# EasyEDA schematic ESP Home Automation.json

## Sheets
1 Sheet_1: TITLE: ESP Relay; REV: 1.0; Date: 2022-01-20; Sheet: 1/4
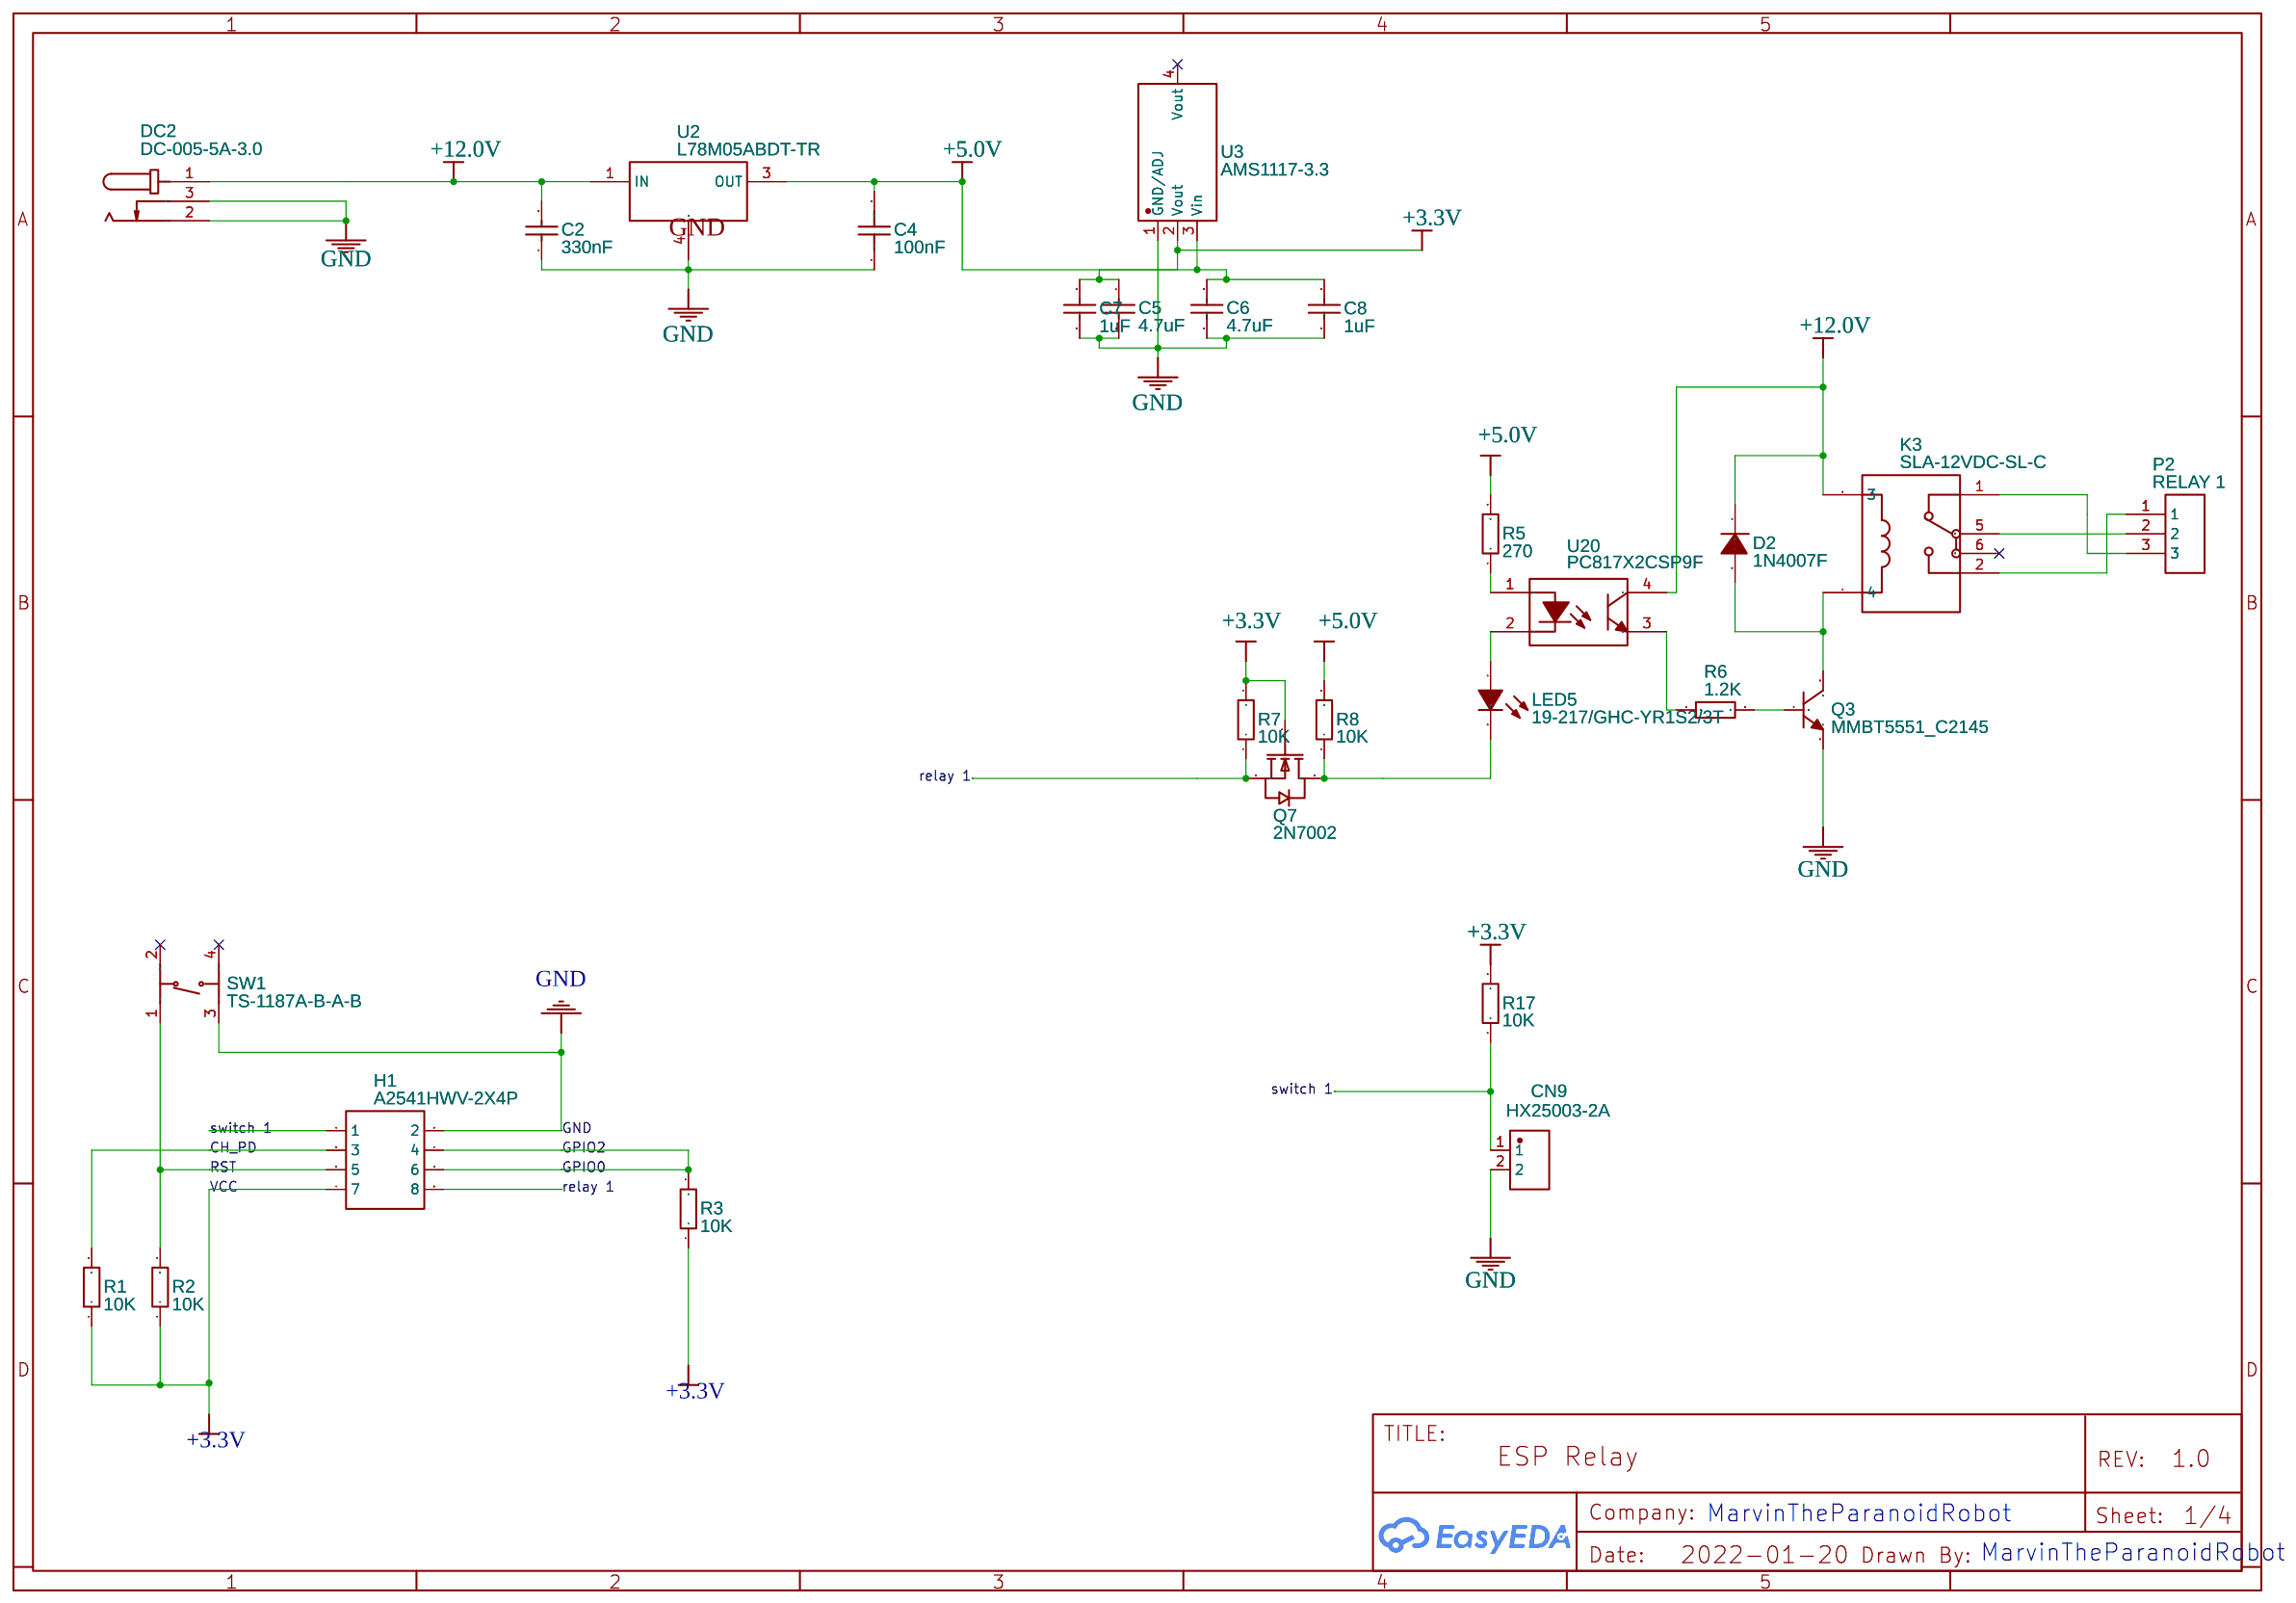
[diagram p0: Sheet_1]
2 Sheet_2: TITLE: ESP Mosfet; Sheet: 2/4
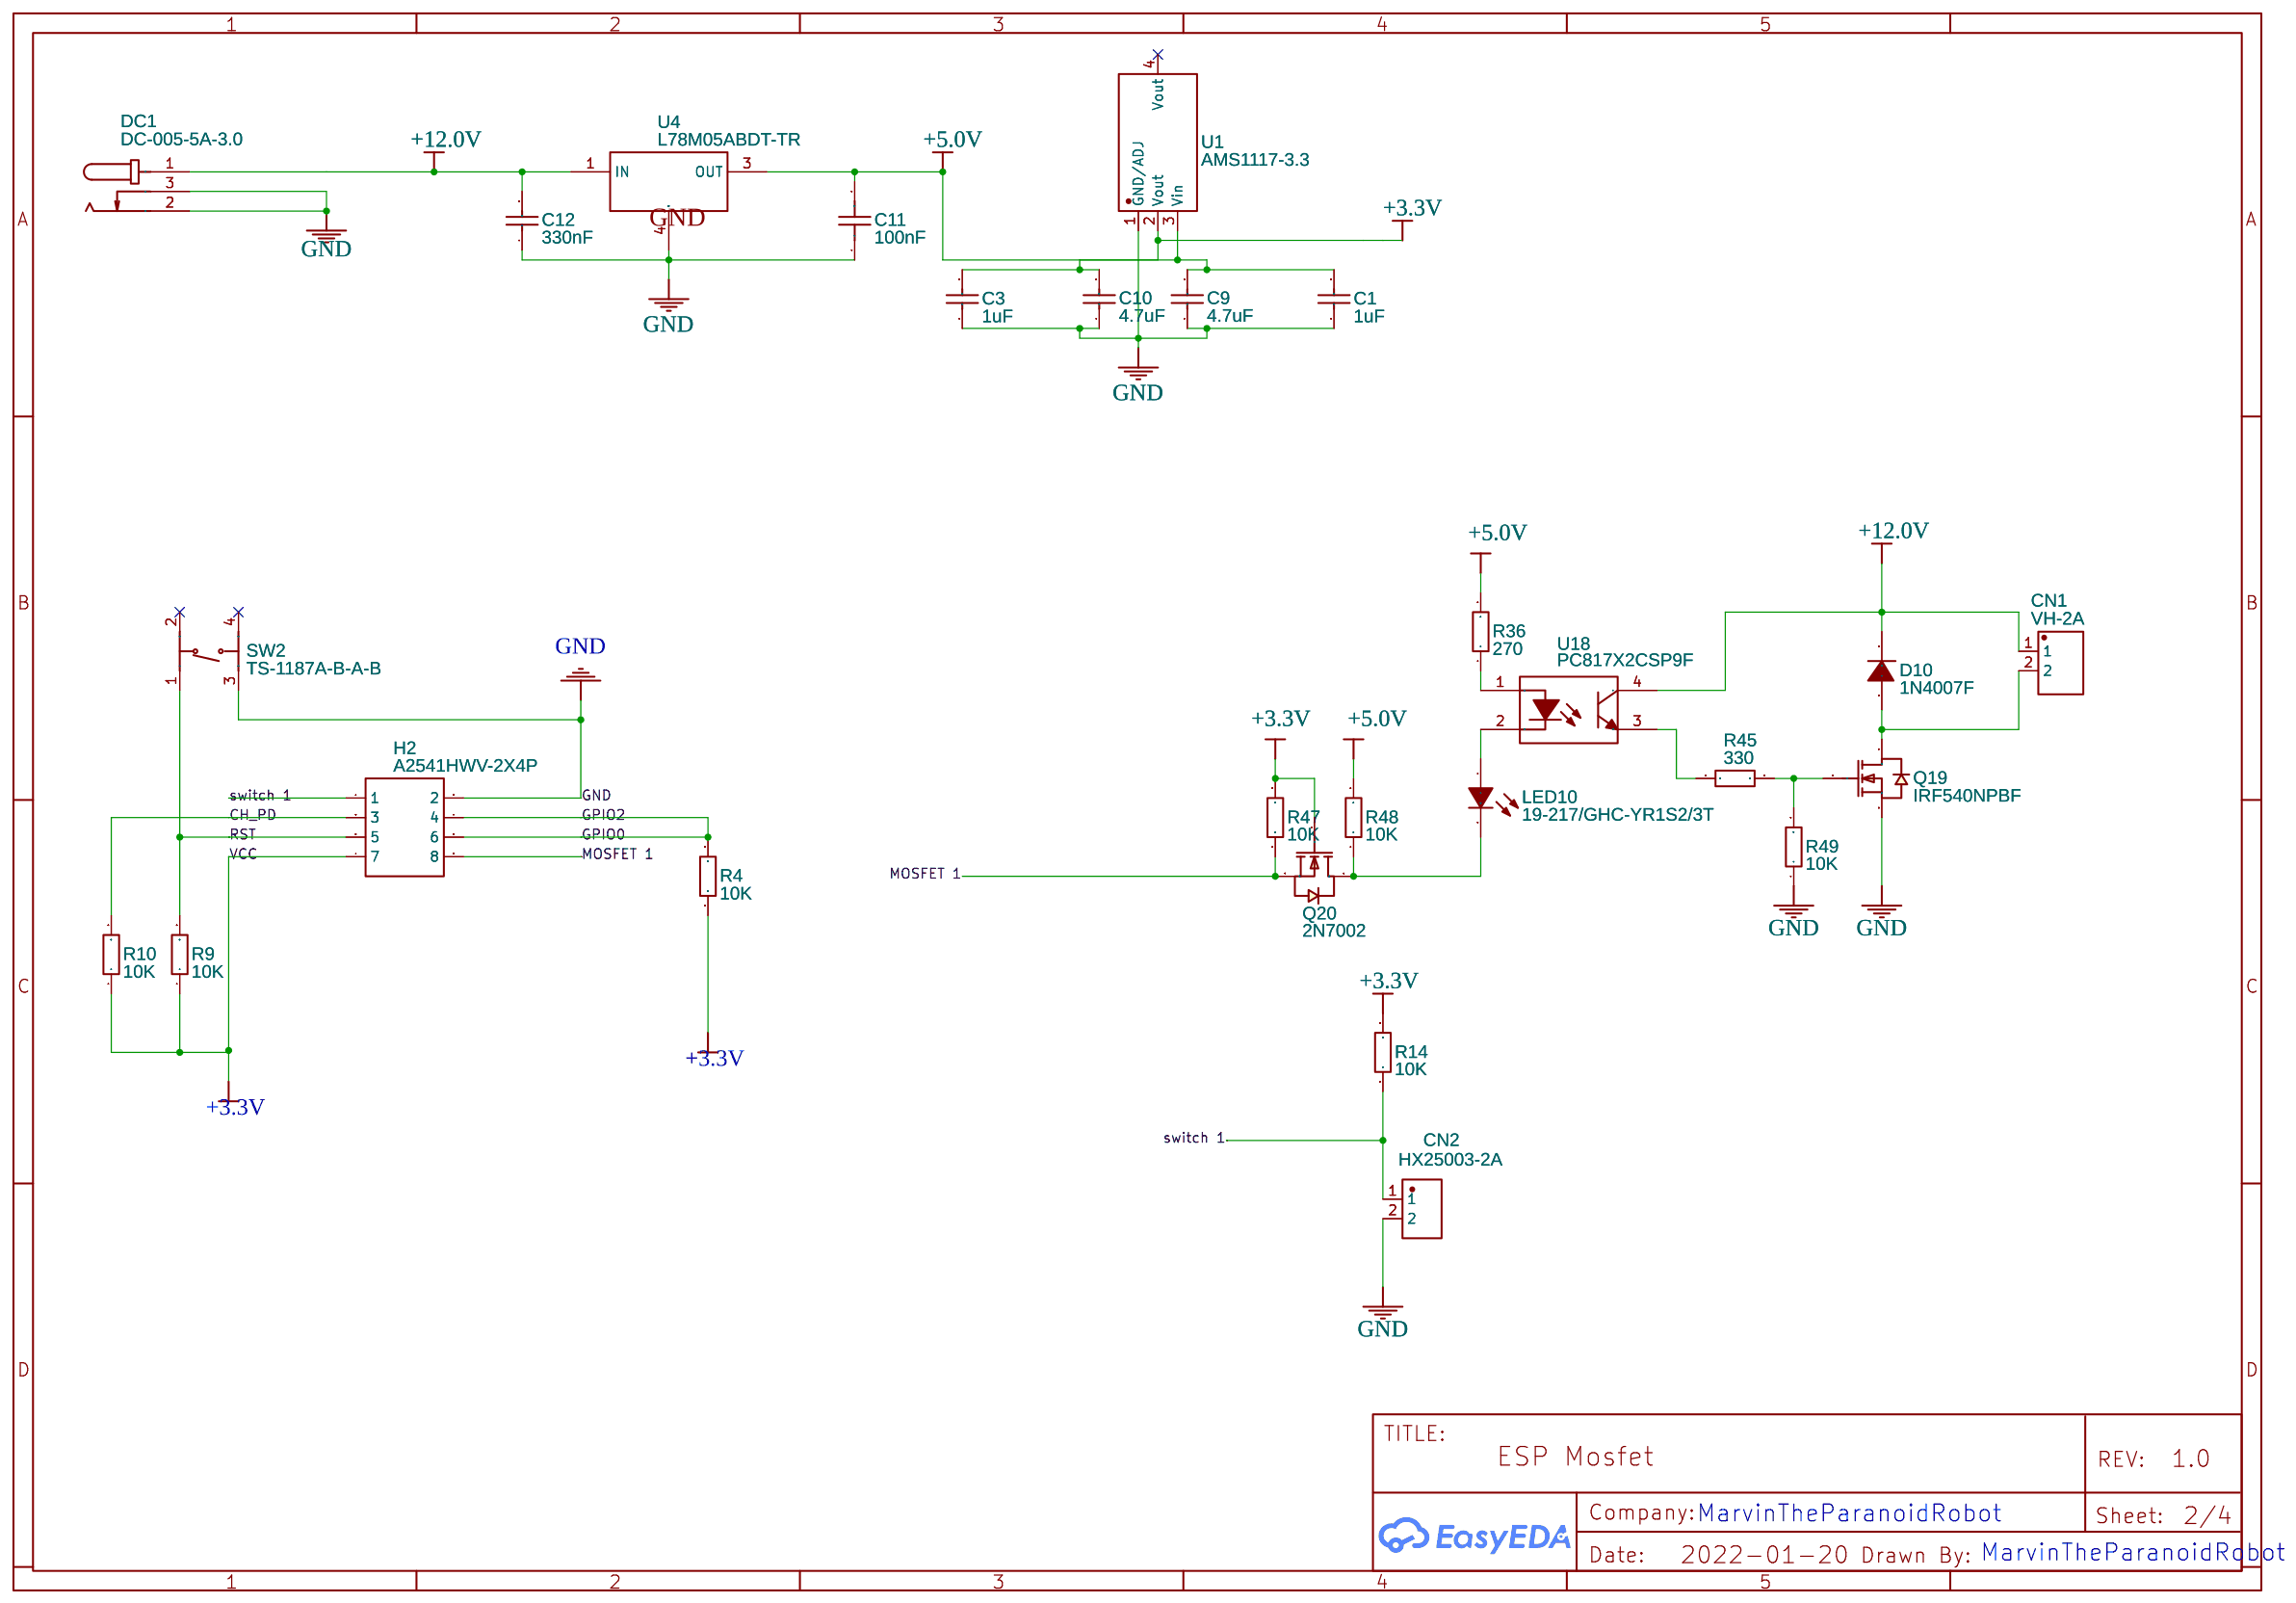
[diagram p1: Sheet_2]
3 Sheet_3: TITLE: ESP WS2801B; Date: 2022-01-21; Sheet: 3/4
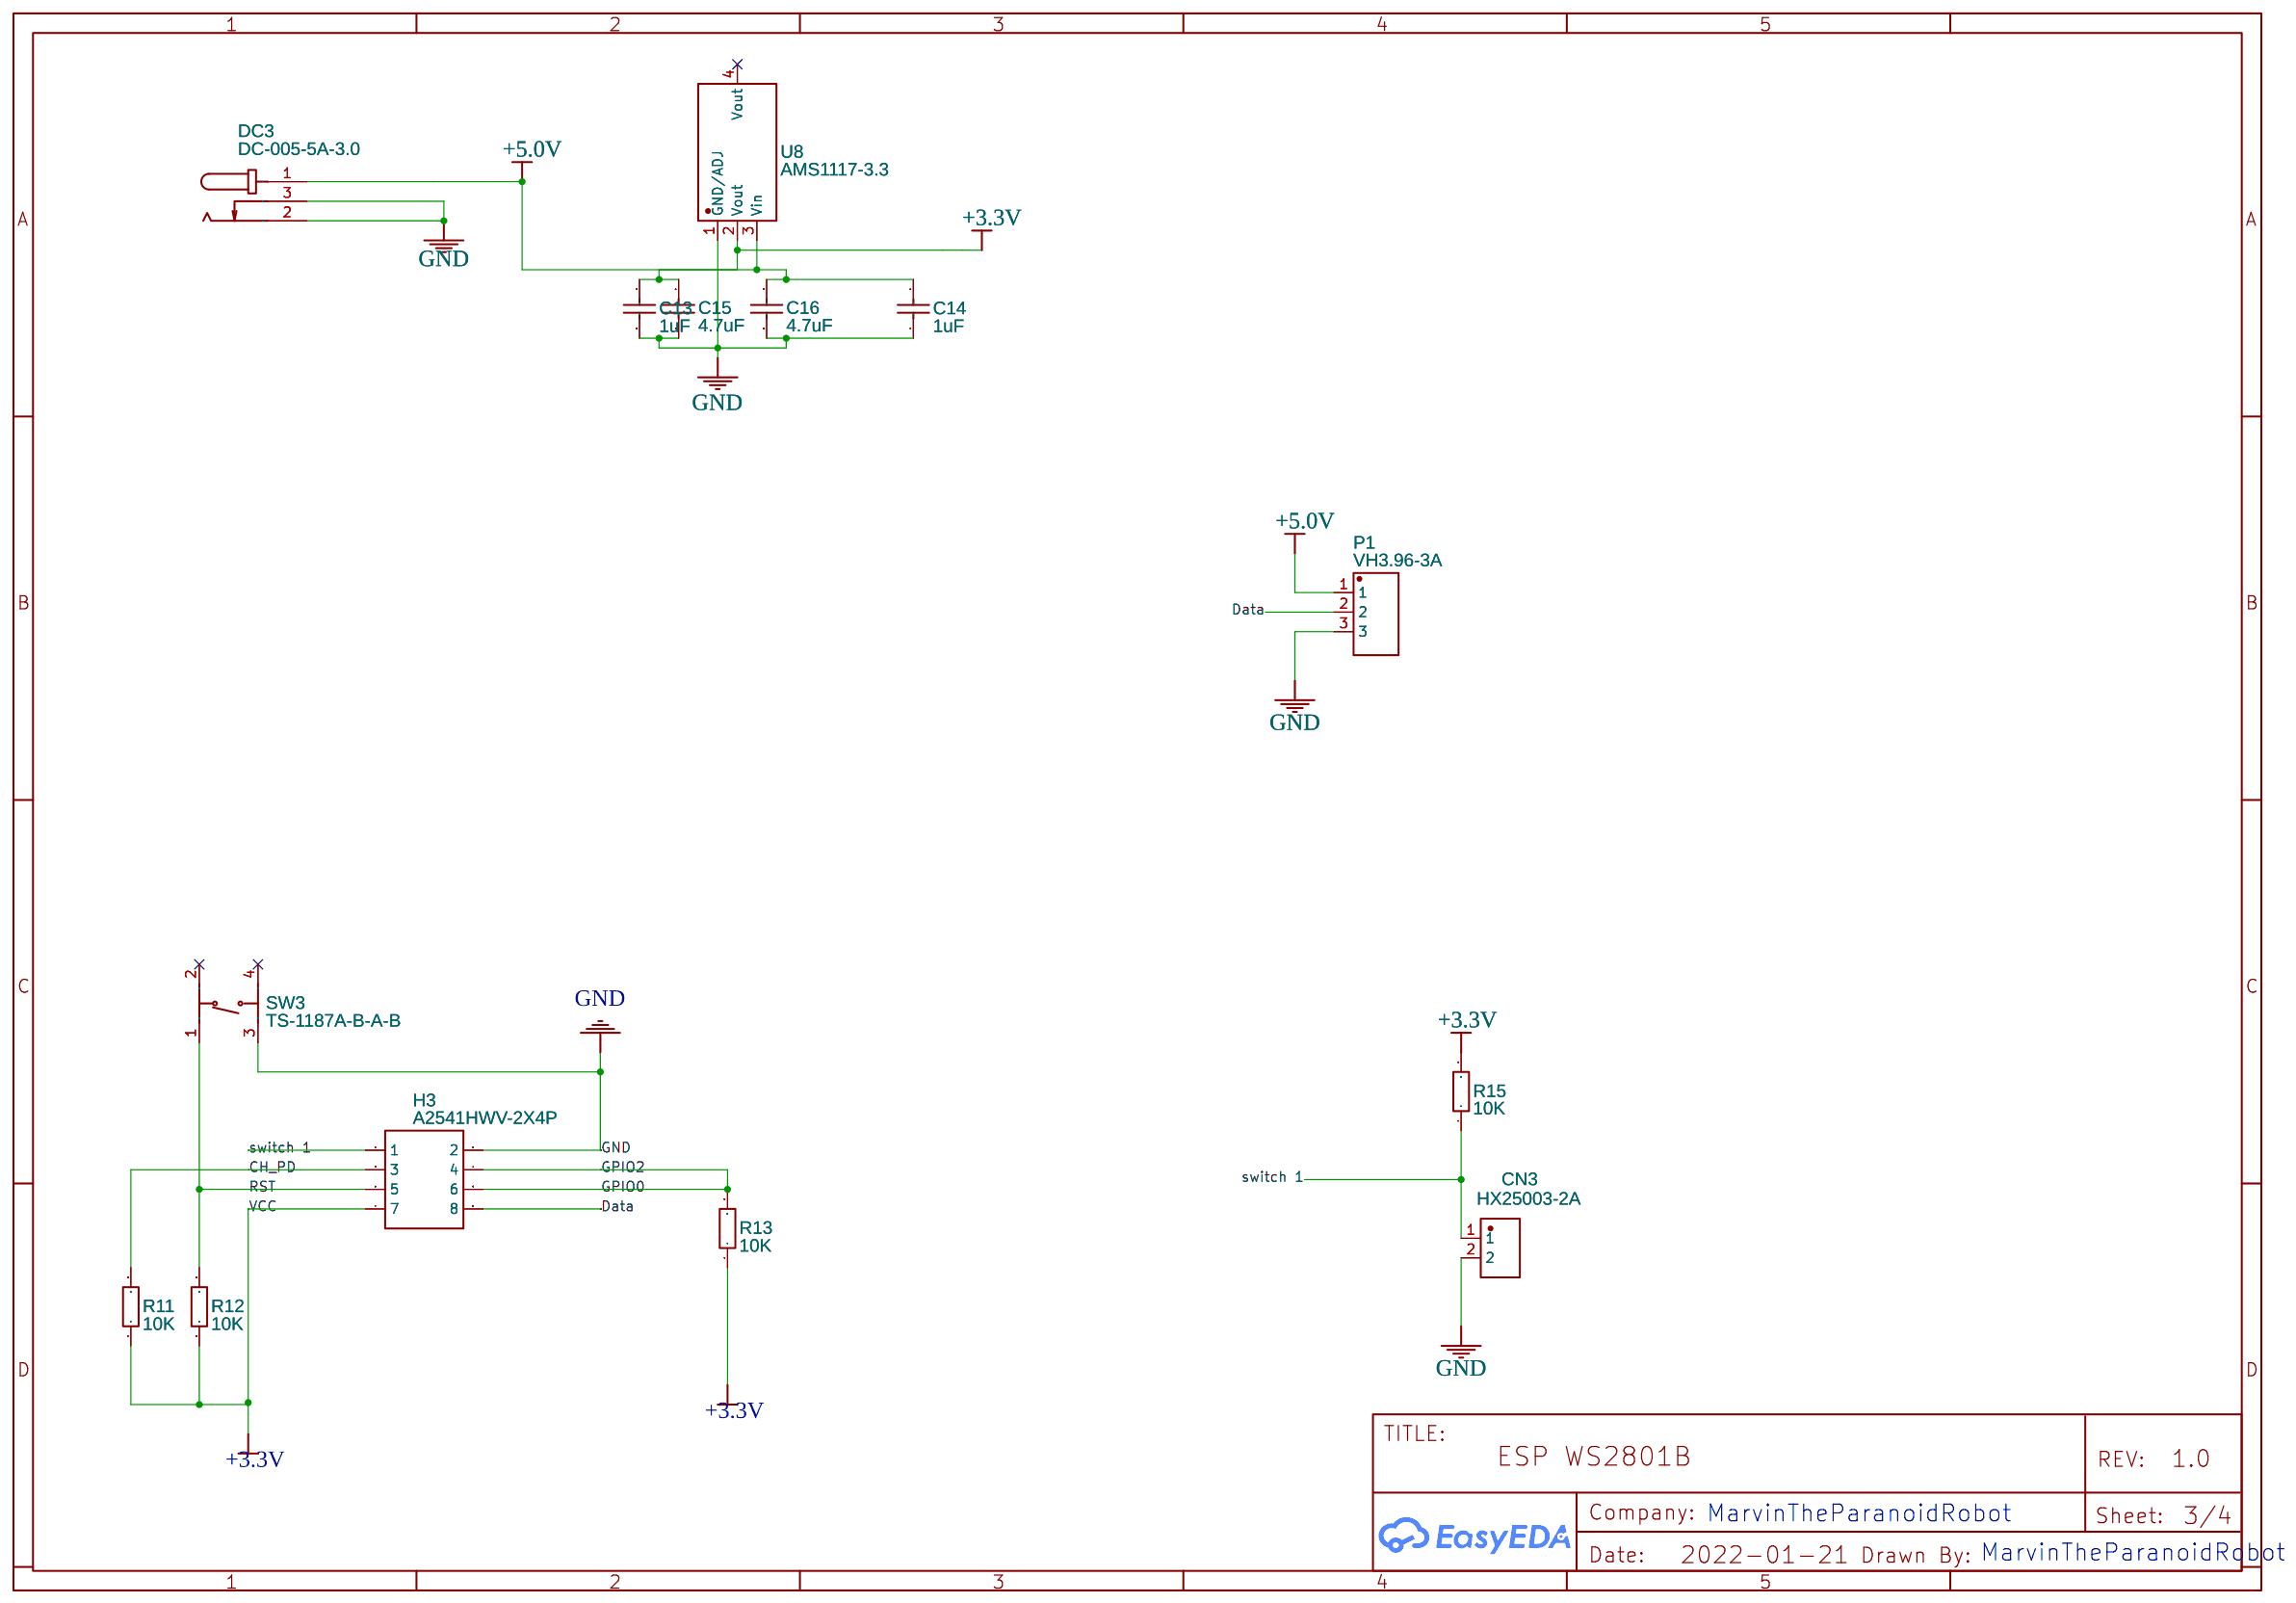
[diagram p2: Sheet_3]
4 Sheet_4: TITLE: Sheet_4; Date: 2022-01-23; Sheet: 4/4; Company: MarvinTheParanoidRobot
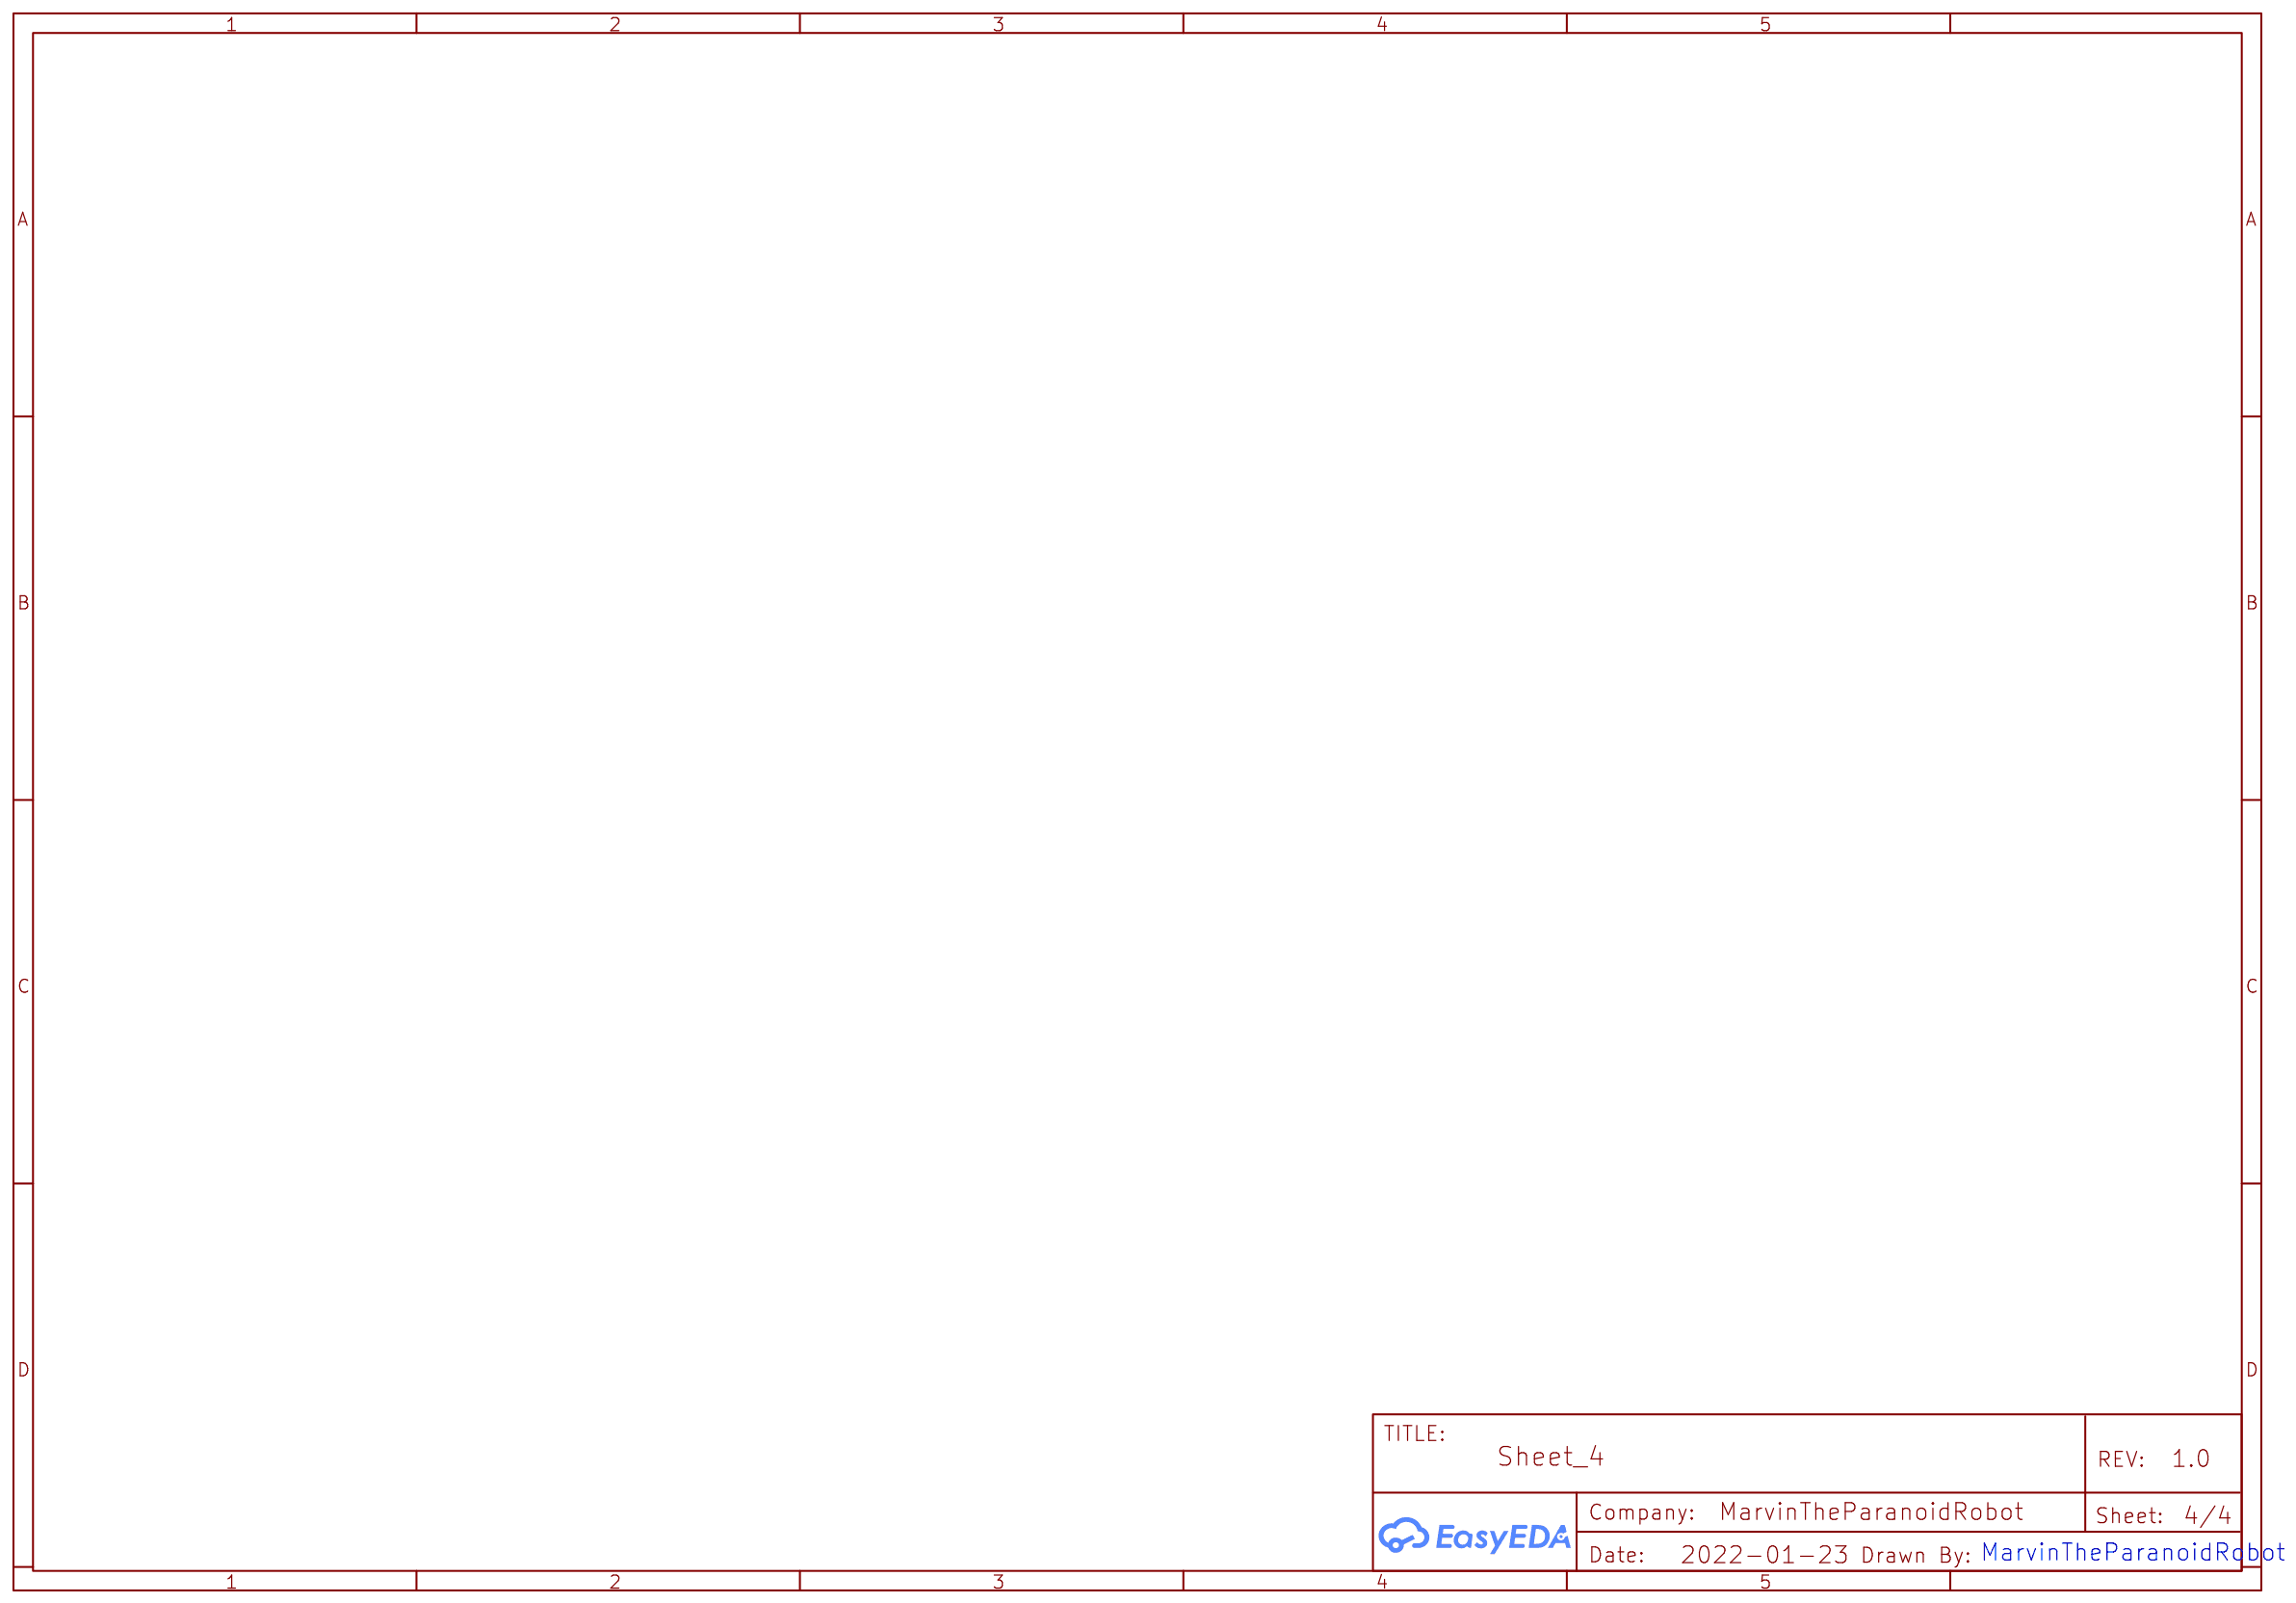
[diagram p3: Sheet_4]

## Parts
sheet Sheet_1
C2  330nF  [C0805]
C4  100nF  [C0603]
C5  4.7uF  [C1206]
C6  4.7uF  [C1206]
C7  1uF  [C0603]
C8  1uF  [C0603]
CN9  HX25003-2A  [CONN-TH_2P-P2.50_HX25003-2A]
D2  1N4007F  [SMAF_L3.5-W2.6-LS4.7-RD]
DC2  DC-005-5A-3.0  [DC-IN-TH_DC-005-5A-3.0]
H1  A2541HWV-2X4P  [HDR-TH_8P-P2.54-V-F-R2-C4-S2.54-1]
K3  SLA-12VDC-SL-C  [RELAY-TH_SLA-12VDC-SL-C]
LED5  19-217/GHC-YR1S2/3T  [LED0603-R-RD]
P2  RELAY 1  [CONN-TH_3P-P5.00_WJ128V-5.0-3P]
Q3  MMBT5551_C2145  [SOT-23-3_L2.9-W1.3-P1.90-LS2.4-BR]
Q7  2N7002  [SOT-23-3_L2.9-W1.3-P1.90-LS2.4-BR]
R1  10K  [R1206]
R2  10K  [R1206]
R3  10K  [R1206]
R5  270  [R0603]
R6  1.2K  [R0805]
R7  10K  [R1206]
R8  10K  [R1206]
R17  10K  [R1206]
SW1  TS-1187A-B-A-B  [SW-SMD_4P-L5.1-W5.1-P3.70-LS6.5-TL-2]
U2  L78M05ABDT-TR  [TO-252-2_L6.5-W6.1-P4.58-LS10.0-TL]
U3  AMS1117-3.3  [SOT-223-3_L6.5-W3.4-P2.30-LS7.0-BR]
U20  PC817X2CSP9F  [SMD-4_L4.6-W6.5-P2.54-LS10.2-TL]
sheet Sheet_2
C1  1uF  [C0603]
C3  1uF  [C0603]
C9  4.7uF  [C1206]
C10  4.7uF  [C1206]
C11  100nF  [C0603]
C12  330nF  [C0805]
CN1  VH-2A  [CONN-TH_VH3.96-2A]
CN2  HX25003-2A  [CONN-TH_2P-P2.50_HX25003-2A]
D10  1N4007F  [SMAF_L3.5-W2.6-LS4.7-RD]
DC1  DC-005-5A-3.0  [DC-IN-TH_DC-005-5A-3.0]
H2  A2541HWV-2X4P  [HDR-TH_8P-P2.54-V-F-R2-C4-S2.54-1]
LED10  19-217/GHC-YR1S2/3T  [LED0603-R-RD]
Q19  IRF540NPBF  [TO-220-3_L10.0-W4.5-P2.54-L]
Q20  2N7002  [SOT-23-3_L2.9-W1.3-P1.90-LS2.4-BR]
R4  10K  [R1206]
R9  10K  [R1206]
R10  10K  [R1206]
R14  10K  [R1206]
R36  270  [R0603]
R45  330  [R0805]
R47  10K  [R1206]
R48  10K  [R1206]
R49  10K  [R1206]
SW2  TS-1187A-B-A-B  [SW-SMD_4P-L5.1-W5.1-P3.70-LS6.5-TL-2]
U1  AMS1117-3.3  [SOT-223-3_L6.5-W3.4-P2.30-LS7.0-BR]
U4  L78M05ABDT-TR  [TO-252-2_L6.5-W6.1-P4.58-LS10.0-TL]
U18  PC817X2CSP9F  [SMD-4_L4.6-W6.5-P2.54-LS10.2-TL]
sheet Sheet_3
C13  1uF  [C0603]
C14  1uF  [C0603]
C15  4.7uF  [C1206]
C16  4.7uF  [C1206]
CN3  HX25003-2A  [CONN-TH_2P-P2.50_HX25003-2A]
DC3  DC-005-5A-3.0  [DC-IN-TH_DC-005-5A-3.0]
H3  A2541HWV-2X4P  [HDR-TH_8P-P2.54-V-F-R2-C4-S2.54-1]
P1  VH3.96-3A  [CONN-TH_3P-P3.96_VH3.96-3A]
R11  10K  [R1206]
R12  10K  [R1206]
R13  10K  [R1206]
R15  10K  [R1206]
SW3  TS-1187A-B-A-B  [SW-SMD_4P-L5.1-W5.1-P3.70-LS6.5-TL-2]
U8  AMS1117-3.3  [SOT-223-3_L6.5-W3.4-P2.30-LS7.0-BR]

## Library data of the parts
C2 C12 = 0805B334K500NT: Supplier: LCSC; Manufacturer: FH; Supplier Part: C1740; JLCPCB Part Class: Basic Part
C4 C11 = CC0603KRX7R9BB104: Supplier: LCSC; Manufacturer: YAGEO; Supplier Part: C14663; JLCPCB Part Class: Basic Part
C5 C6 C9 C10 C15 C16 = 1206B475K500NT: Supplier: LCSC; Manufacturer: FH; Supplier Part: C29823; JLCPCB Part Class: Basic Part
C1 C3 C7 C8 C13 C14 = CL10A105KB8NNNC: Supplier: LCSC; Manufacturer: SAMSUNG; Supplier Part: C15849; JLCPCB Part Class: Basic Part
CN2 CN3 CN9 = HX25003-2A: Supplier: LCSC; Supplier Part: C442299; Manufacturer: HX(Zhejiang Yueqing Hongxing Elec); Contributor: LCSC; JLCPCB Part Class: Extended Part
D2 D10 = 1N4007F: Supplier: LCSC; Manufacturer: SK; Supplier Part: C110856; JLCPCB Part Class: Extended Part
DC1-DC3 = DC-005-5A-3.0: Supplier: LCSC; Supplier Part: C388625; Manufacturer: XKB Enterprise; Contributor: LCSC; JLCPCB Part Class: Extended Part
H1-H3 = A2541HWV-2X4P: Supplier: LCSC; Supplier Part: C239344; Manufacturer: Changjiang Connectors; Manufacturer Part: A2541HWV-2x4P; Contributor: LCSC; link: https://item.szlcsc.com/238448.html?ref=editor&logined=true; JLCPCB Part Class: Extended Part
K3 = SLA-12VDC-SL-C: Supplier: LCSC; Manufacturer: SONGLE; Contributor: LCSC; Supplier Part: C125736; JLCPCB Part Class: Extended Part
LED5 LED10 = 19-217/GHC-YR1S2/3T: Supplier: LCSC; Manufacturer: EVERLIGHT; Supplier Part: C72043; JLCPCB Part Class: Basic Part
P2 = WJ128V-5.0-3P: Supplier: LCSC; Manufacturer: ReliaPro; Supplier Part: C8270; JLCPCB Part Class: Extended Part
Q3 = MMBT5551_C2145: Supplier: LCSC; Manufacturer: CJ; Manufacturer Part: MMBT5551; Supplier Part: C2145; JLCPCB Part Class: Basic Part
Q7 Q20 = 2N7002: Supplier: LCSC; Manufacturer: CJ; Supplier Part: C8545; JLCPCB Part Class: Basic Part
R1-R4 R7-R15 R17 R47-R49 = 1206W4F1002T5E: Supplier: LCSC; Manufacturer: UniOhm; Supplier Part: C17902; JLCPCB Part Class: Basic Part
R5 R36 = 0603WAF2700T5E: Supplier: LCSC; Manufacturer: UniOhm; Supplier Part: C22966; JLCPCB Part Class: Basic Part
R6 = 0805W8F1201T5E: Supplier: LCSC; Manufacturer: UniOhm; Supplier Part: C17379; JLCPCB Part Class: Basic Part
SW1-SW3 = TS-1187A-B-A-B: Supplier: LCSC; Supplier Part: C318884; Manufacturer: XKB Enterprise; Contributor: LCSC; JLCPCB Part Class: Extended Part
U2 U4 = L78M05ABDT-TR: Supplier: LCSC; Manufacturer: STMicroelectronics; Supplier Part: C58069; JLCPCB Part Class: Basic Part
U1 U3 U8 = AMS1117-3.3: sourceId: dwIGgezVh; Supplier: LCSC; Manufacturer: AMS; Supplier Part: C6186; JLCPCB Part Class: Basic Part
U18 U20 = PC817X2CSP9F: Supplier: LCSC; Manufacturer: SHARP; Supplier Part: C66405; JLCPCB Part Class: Extended Part
CN1 = VH-2A: Supplier: LCSC; Manufacturer: BOOMELE; Supplier Part: C16728; JLCPCB Part Class: Extended Part
Q19 = IRF540NPBF: Supplier: LCSC; Manufacturer: Infineon; Supplier Part: C2566; JLCPCB Part Class: Extended Part
R45 = 0805W8F3300T5E: Supplier: LCSC; Manufacturer: UniOhm; Supplier Part: C17630; JLCPCB Part Class: Basic Part
P1 = VH3.96-3A: Supplier: LCSC; Manufacturer: BOOMELE; Supplier Part: C20547; JLCPCB Part Class: Extended Part

## Nets
+3.3V: C3.2 C5.2 C7.2 C10.2 C13.2 C15.2 H1.7 H2.7 H3.7 Q7.1(G) Q20.1(G) R1.1 R2.1 R3.1 R4.1 R7.2 R9.1 R10.1 R11.1 R12.1 R13.1 R14.2 R15.2 R17.2 R47.2 U1.2(Vout) U3.2(Vout) U8.2(Vout)
+5.0V: C1.2 C4.2 C6.2 C8.2 C9.2 C11.2 C14.2 C16.2 DC3.1 P1.1 R5.2 R8.2 R36.2 R48.2 U1.3(Vin) U2.3(OUT) U3.3(Vin) U4.3(OUT) U8.3(Vin)
+12.0V: C2.2 C12.2 CN1.1 D2.1(C) D10.1(C) DC1.1 DC2.1 K3.3 U2.1(IN) U4.1(IN) U18.4 U20.4
GND: C1.1 C2.1 C3.1 C4.1 C5.1 C6.1 C7.1 C8.1 C9.1 C10.1 C11.1 C12.1 C13.1 C14.1 C15.1 C16.1 CN2.2 CN3.2 CN9.2 DC1.2 DC1.3 DC2.2 DC2.3 DC3.2 DC3.3 H1.2 H2.2 H3.2 P1.3 Q3.2(E) Q19.3(S) R49.1 SW1.3(C) SW2.3(C) SW3.3(C) U1.1(GND/ADJ) U2.4(GND) U3.1(GND/ADJ) U4.4(GND) U8.1(GND/ADJ)
CH_PD: H1.3 H2.3 H3.3 R1.2 R10.2 R11.2
Data: H3.8 P1.2
GPIO0: H1.4 H1.6 H2.4 H2.6 H3.4 H3.6 R3.2 R4.2 R13.2
MOSFET 1: H2.8 Q20.2(S) R47.1
relay 1: H1.8 Q7.2(S) R7.1
RST: H1.5 H2.5 H3.5 R2.2 R9.2 R12.2 SW1.1(A) SW2.1(A) SW3.1(A)
switch 1: CN2.1 CN3.1 CN9.1 H1.1 H2.1 H3.1 R14.1 R15.1 R17.1
Net-(CN1-2): CN1.2 D10.2(A) Q19.2(D)
Net-(D2-2): D2.2(A) K3.4 Q3.3(C)
Net-(K3-1): K3.1 P2.3
Net-(K3-2): K3.2 P2.1
Net-(K3-5): K3.5 P2.2
Net-(LED5-1): LED5.1(A) U20.2
Net-(LED5-2): LED5.2(C) Q7.3(D) R8.1
Net-(LED10-1): LED10.1(A) U18.2
Net-(LED10-2): LED10.2(C) Q20.3(D) R48.1
Net-(Q3-1): Q3.1(B) R6.2
Net-(Q19-1): Q19.1(G) R45.2 R49.2
Net-(R5-1): R5.1 U20.1
Net-(R6-1): R6.1 U20.3
Net-(R36-1): R36.1 U18.1
Net-(R45-1): R45.1 U18.3

Not connected (* = marked no-connect by the designer): K3 6*; SW1 2(B)* 4(D)*; SW2 2(B)* 4(D)*; SW3 2(B)* 4(D)*; U1 4(Vout)*; U3 4(Vout)*; U8 4(Vout)*

## Notes on the sheets
sheet 1
- MarvinTheParanoidRobot
- MarvinTheParanoidRobot
sheet 2
- MarvinTheParanoidRobot
- MarvinTheParanoidRobot
sheet 3
- MarvinTheParanoidRobot
- MarvinTheParanoidRobot
sheet 4
- MarvinTheParanoidRobot
